# Altium schematic sheet RFCtl.SchDoc
size 420 x 297 mm; Address1: Address1; Address2: Address2; Address3: Address3; Address4: Address4; SheetNumber: 1; Scale: 1:1; Разраб.: Иванов; Обозначение документа: АБВГ.123456.001 Э3; Пров.: Петров; Утв.: Сидоров; Наименование организации: ОАО "Концерн "МПО-Гидроприбор"; Перв. применение: АБВГ.123456.000; Наименование изделия 1: Плата; Наименование изделия 2: Схема электрическая; Наименование изделия 3: принципиальная; Нач. отд.: Нач. отд.; Фамилия нач. отд.: Сидоров
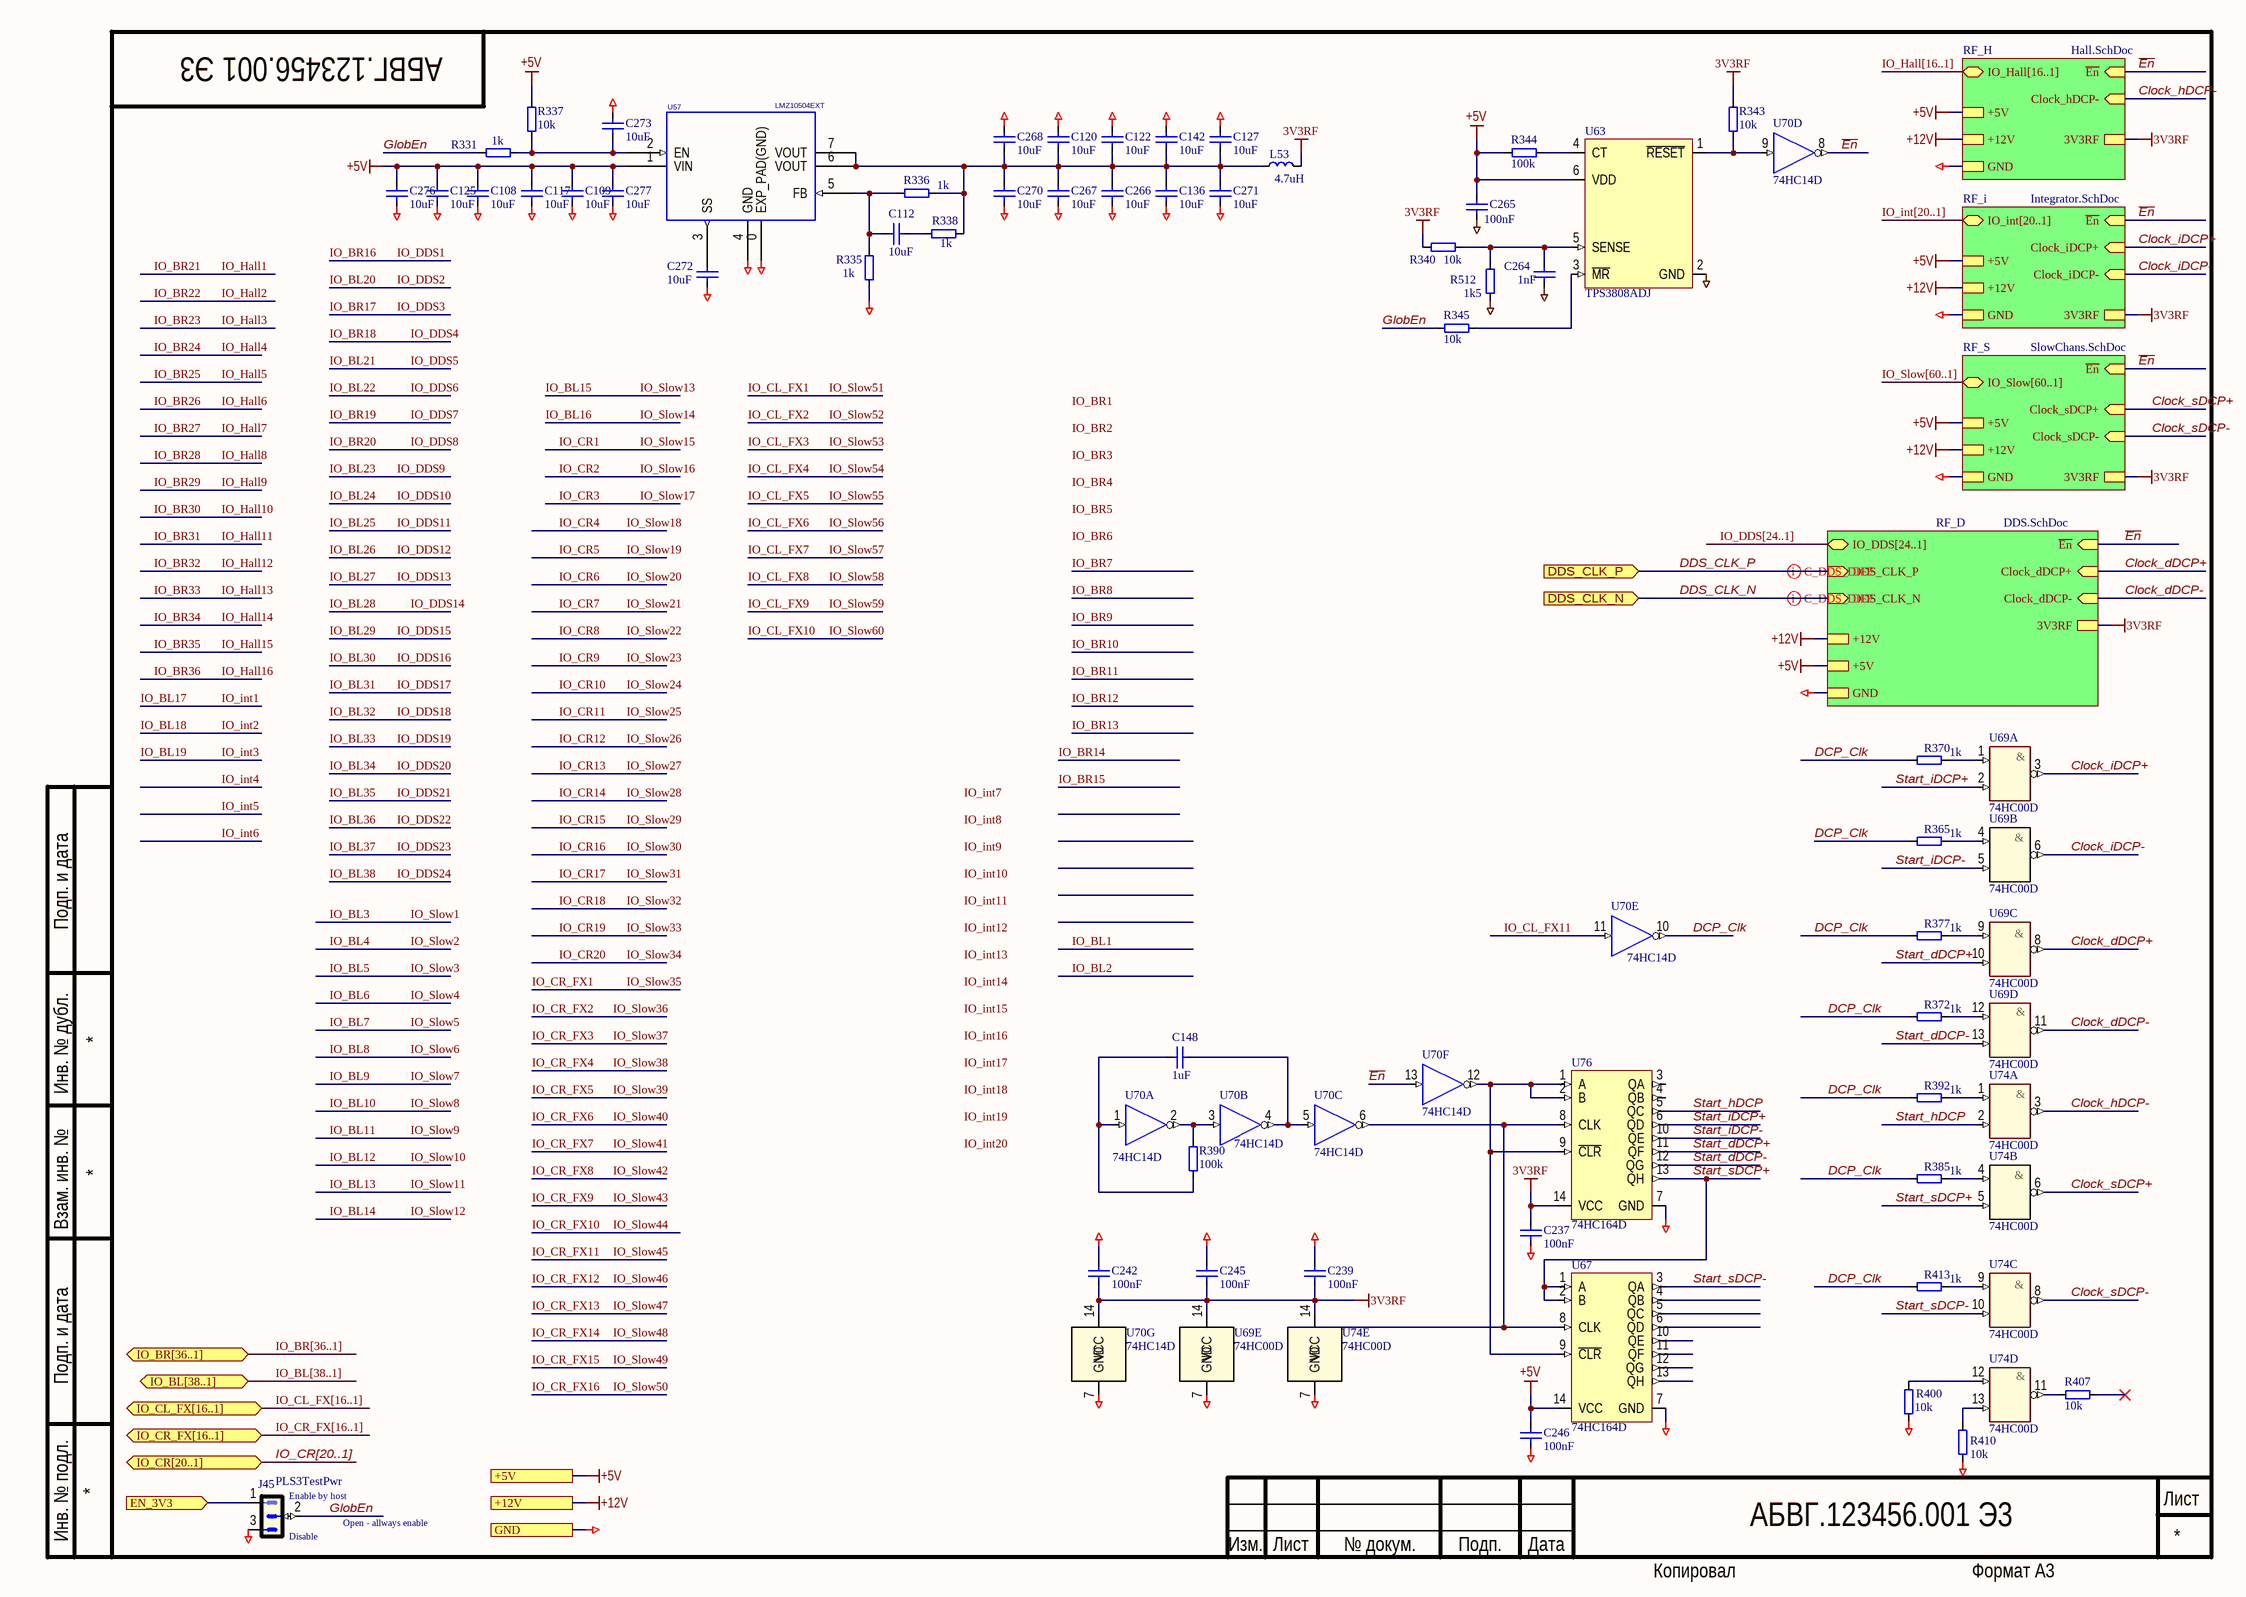
[diagram p0: RFCtl.SchDoc]

## Parts
C108  10uF  [SMD0805CAP]
C109  10uF  [SMD0805CAP]
C112  10uF  [SMD0805CAP]
C117  10uF  [SMD0805CAP]
C120  10uF  [SMD0805CAP]
C122  10uF  [SMD0805CAP]
C125  10uF  [SMD0805CAP]
C127  10uF  [SMD0805CAP]
C136  10uF  [SMD0805CAP]
C142  10uF  [SMD0805CAP]
C148  1uF  [SMD0805CAP]
C237  100nF  [SMD0805CAP]
C239  100nF  [SMD0805CAP]
C242  100nF  [SMD0805CAP]
C245  100nF  [SMD0805CAP]
C246  100nF  [SMD0805CAP]
C264  1nF  [SMD0805CAP]
C265  100nF  [SMD0805CAP]
C266  10uF  [SMD0805CAP]
C267  10uF  [SMD0805CAP]
C268  10uF  [SMD0805CAP]
C270  10uF  [SMD0805CAP]
C271  10uF  [SMD0805CAP]
C272  10uF  [SMD0805CAP]
C273  10uF  [SMD0805CAP]
C276  10uF  [SMD0805CAP]
C277  10uF  [SMD0805CAP]
J45  PLS3TestPwr  [PLS3]
L53  value 4.7uH  [IND_3225_MURATA_LQH_N]  (hidden comment: LQH32PN4R7NN0L)
R331  1k  [SMD0805RES]
R335  1k  [SMD0805RES]
R336  1k  [SMD0805RES]
R337  10k  [SMD0805RES]
R338  1k  [SMD0805RES]
R340  10k  [SMD0805RES]
R343  10k  [SMD0805RES]
R344  100k  [SMD0805RES]
R345  10k  [SMD0805RES]
R365  1k  [SMD0805RES]
R370  1k  [SMD0805RES]
R372  1k  [SMD0805RES]
R377  1k  [SMD0805RES]
R385  1k  [SMD0805RES]
R390  100k  [SMD0805RES]
R392  1k  [SMD0805RES]
R400  10k  [SMD0805RES]
R407  10k  [SMD0805RES]
R410  10k  [SMD0805RES]
R413  1k  [SMD0805RES]
R512  1k5  [SMD0805RES]
U57  LMZ10504EXT  [TO-PMOD7]
U63  TPS3808ADJ  [SOT95P270X145-6N]
U67  74HC164D  [SOIC127P600X175-14N]
U69  74HC00D  [SOIC127P600X175-14N]  (parts A,B,C,D,E of 5)
U70  74HC14D  [SOIC127P600X175-14N]  (parts A,B,C,D,E,F,G of 7)
U74  74HC00D  [SOIC127P600X175-14N]  (parts A,B,C,D,E of 5)
U76  74HC164D  [SOIC127P600X175-14N]

## Sub-sheets
RF_D = DDS.SchDoc: IO_DDS[24..1] (bidir), ~{En} (in), Clock_dDCP- (in), Clock_dDCP+ (in), DDS_CLK_N (in), DDS_CLK_P (in), GND, +5V, 3V3RF, +12V
RF_H = Hall.SchDoc: IO_Hall[16..1] (bidir), ~{En} (in), Clock_hDCP- (in), GND, +12V, +5V, 3V3RF
RF_i = Integrator.SchDoc: IO_int[20..1] (bidir), ~{En} (in), Clock_iDCP- (in), Clock_iDCP+ (in), GND, +12V, +5V, 3V3RF
RF_S = SlowChans.SchDoc: IO_Slow[60..1] (bidir), ~{En} (in), Clock_sDCP- (in), Clock_sDCP+ (in), +5V, +12V, GND, 3V3RF

## Ports
+5V, +12V, DDS_CLK_N (in), DDS_CLK_P (in), EN_3V3 (in), GND, IO_BL[38..1] (bidir), IO_BR[36..1] (bidir), IO_CL_FX[16..1] (bidir), IO_CR[20..1] (bidir), IO_CR_FX[16..1] (bidir)

## Nets
3V3RF: C237.2 C239.1 C242.1 C245.1 L53.2 R340.1 R343.1 U69.14(VCC) U70.14(VCC) U74.14(VCC) U76.14(VCC) ; sheet RF_H/3V3RF, sheet RF_i/3V3RF, sheet RF_D/3V3RF, sheet RF_S/3V3RF
+5V: C108.2 C109.2 C117.2 C125.2 C246.2 C265.2 C276.2 C277.2 R337.2 R344.1 U57.1(VIN) U63.6(VDD) U67.14(VCC) ; port +5V, sheet RF_H/+5V, sheet RF_i/+5V, sheet RF_D/+5V, sheet RF_S/+5V
+12V: port +12V, sheet RF_H/+12V, sheet RF_i/+12V, sheet RF_D/+12V, sheet RF_S/+12V
GND: C108.1 C109.1 C117.1 C120.2 C122.2 C125.1 C127.1 C136.1 C142.2 C237.1 C239.2 C242.2 C245.2 C246.1 C264.1 C265.1 C266.1 C267.1 C268.2 C270.1 C271.1 C272.1 C273.2 C276.1 C277.1 J45.3 R335.1 R400.1 R410.1 R512.1 U57.0(EXP_PAD(GND)) U57.4(GND) U63.2(GND) U67.7(GND) U69.7(GND) U70.7(GND) U74.7(GND) U76.7(GND) ; port GND, sheet RF_H/GND, sheet RF_i/GND, sheet RF_D/GND, sheet RF_S/GND
~{En}: U70.8(OUT) U70.13(IN) ; sheet RF_H/~{En}, sheet RF_i/~{En}, sheet RF_D/~{En}, sheet RF_S/~{En}
Clock_dDCP+: U69.8(OUT) ; sheet RF_D/Clock_dDCP+
Clock_dDCP-: U69.11(OUT) ; sheet RF_D/Clock_dDCP-
Clock_hDCP-: U74.3(OUT) ; sheet RF_H/Clock_hDCP-
Clock_iDCP+: U69.3(OUT) ; sheet RF_i/Clock_iDCP+
Clock_iDCP-: U69.6(OUT) ; sheet RF_i/Clock_iDCP-
Clock_sDCP+: U74.6(OUT) ; sheet RF_S/Clock_sDCP+
Clock_sDCP-: U74.8(OUT) ; sheet RF_S/Clock_sDCP-
DCP_Clk: R365.2 R370.2 R372.2 R377.2 R385.2 R392.2 R413.2 U70.10(OUT)
DDS_CLK_N: port DDS_CLK_N, sheet RF_D/DDS_CLK_N
DDS_CLK_P: port DDS_CLK_P, sheet RF_D/DDS_CLK_P
EN_3V3: J45.1 ; port EN_3V3
GlobEn: J45.2 R331.2 R345.2
IO_CL_FX11: U70.11(IN)
Start_dDCP+: U69.10(IN) U76.11(QF)
Start_dDCP-: U69.13(IN) U76.12(QG)
Start_hDCP: U74.2(IN) U76.5(QC)
Start_iDCP+: U69.2(IN) U76.6(QD)
Start_iDCP-: U69.5(IN) U76.10(QE)
Start_sDCP+: U67.1(A) U67.2(B) U74.5(IN) U76.13(QH)
Start_sDCP-: U67.3(QA) U74.10(IN)
NetC112_1: C112.1 R335.2 R336.1 U57.5(FB)
NetC112_2: C112.2 R338.2
NetC120_1: C120.1 C122.1 C127.2 C136.2 C142.1 C266.2 C267.2 C268.1 C270.2 C271.2 L53.1 R336.2 R338.1 U57.6(VOUT) U57.7(VOUT)
NetC148_1: C148.1 U70.4(OUT) U70.5(IN)
NetC148_2: C148.2 R390.1 U70.1(IN)
NetC264_2: C264.2 R340.2 R512.2 U63.5(SENSE)
NetC272_2: C272.2 U57.3(SS)
NetC273_1: C273.1 R331.1 R337.1 U57.2(EN)
NetR343_2: R343.2 U63.1(~{RESET}) U70.9(IN)
NetR344_2: R344.2 U63.4(CT)
NetR345_1: R345.1 U63.3(~{MR})
NetR365_1: R365.1 U69.4(IN)
NetR370_1: R370.1 U69.1(IN)
NetR372_1: R372.1 U69.12(IN)
NetR377_1: R377.1 U69.9(IN)
NetR385_1: R385.1 U74.4(IN)
NetR390_2: R390.2 U70.2(OUT) U70.3(IN)
NetR392_1: R392.1 U74.1(IN)
NetR400_2: R400.2 U74.12(IN)
NetR407_2: R407.2 U74.11(OUT)
NetR410_2: R410.2 U74.13(IN)
NetR413_1: R413.1 U74.9(IN)
NetU67_8: U67.8(CLK) U70.6(OUT) U76.8(CLK)
NetU67_9: U67.9(~{CLR}) U70.12(OUT) U76.1(A) U76.2(B) U76.9(~{CLR})

Not connected (* = marked no-connect by the designer): R407 1*; U67 4(QB) 5(QC) 6(QD) 10(QE) 11(QF) 12(QG) 13(QH); U76 3(QA) 4(QB)

## Buses and harness runs
bus IO_BL[38..1] = port IO_BL[38..1]
bus IO_BR[36..1] = port IO_BR[36..1]
bus IO_CL_FX[16..1] = port IO_CL_FX[16..1]
bus IO_CR[20..1] = port IO_CR[20..1]
bus IO_CR_FX[16..1] = port IO_CR_FX[16..1]
bus IO_DDS[24..1] = sheet RF_D/IO_DDS[24..1]
bus IO_Hall[16..1] = sheet RF_H/IO_Hall[16..1]
bus IO_int[20..1] = sheet RF_i/IO_int[20..1]
bus IO_Slow[60..1] = sheet RF_S/IO_Slow[60..1]

## Layout directives
differential pair; rule Differential Pairs Routing [Pref Gap = 0.175mm    Min Gap  = 0.075mm    Max Gap  = 0.5mmPref Width = 0.25mm    Min Width  = 0.075mm    Max Width  = 0.5mm]: DDS_CLK_N, DDS_CLK_P

## Notes on the sheet
- (near J45) Disable
- (near J45) Enable by host
- Open - allways enable
- Labels drawn without touching a wire or pin: IO_BR1, IO_BR2, IO_BR3, IO_BR4, IO_BR5, IO_BR6, IO_int7, IO_int8, IO_int9, IO_int10, IO_int11, IO_int12, IO_int13, IO_int14, IO_int15, IO_int16, IO_int17, IO_int18, IO_int19, IO_int20
- Подп. и дата
- Инв. № дубл.
- Взам. инв. №
- Инв. № подл.
- Изм.
- Лист
- № докум.
- Подп.
- Дата
- Копировал
- Формат А3
- (in symbol 74HC00D, part A) &
- (in symbol 74HC00D, part B) &
- (in symbol 74HC00D, part C) &
- (in symbol 74HC00D, part D) &

## Library data of the parts
C108 C109 C117 C120 C122 C125 C127 C136 C142 C266-C268 C270-C273 C276 C277 = C0805: Чип конденсатор 0805; Pkg: SMD0805; Vendor: Vishay; SMD Solders: 2; Tolerance: 20%; Voltage: 25V; DielectricType: X5R; Solder Option: RM; Device: Cap0805; Value: 10uF; Price: 2
C112 C148 C237 C239 C242 C245 C246 C264 C265 = C0805: Чип конденсатор 0805; Voltage: 25V; Vendor: Vishay; DielectricType: X5R; SMD Solders: 2; Solder Option: RM; Tolerance: 20%; Pkg: SMD0805; Device: Cap0805; Price: 2
  C112: Value: 10uF
  C148: Value: 1uF
  C237 C239 C242 C245 C246 C265: Value: 100nF
  C264: Value: 1nF
J45 = PLS3: Vendor: Confly; SMD Solders: 0; Solder Option: RM; THD Solders: 3; Price: 1; Value: TestPwr; Device: PLS3
L53 = LQH32PN4R7NN0L: Inductor, Fixed, 1210, 4.7uH, 216mOhm, 1A, 30%; Pkg: 1210; Vendor: Murata; Maintainer: Evgeniy Kotov; SMD Solders: 2; THD Solders: 0; DC Current: 750mA; Tolerance: 20%; DC Resistance: 380mΩ; PartField: LQH32PN4R7NN0L; Release Date: 30.03.2017; Last Change Data: 30.03.2017; Temperature Range: -40°C to +105°C
R331 R338 R365 R370 R372 R377 R385 R392 R413 = R0805: Чип резистор 0805; Pkg: SMD0805; Vendor: Vishay; SMD Solders: 2; Tolerance: 1%; Solder Option: RM; TC: 100ppm/C; Pwr: 125mW; Device: Res0805; Value: 1k; Price: 2
R335-R337 R340 R343 R345 R390 R400 R407 R410 R512 = R0805: Чип резистор 0805; Vendor: Vishay; SMD Solders: 2; Solder Option: RM; TC: 100ppm/C; Tolerance: 1%; Pkg: SMD0805; Pwr: 125mW; Device: Res0805; Price: 2
  R335 R336: Value: 1k
  R337 R340 R343 R345 R400 R407 R410: Value: 10k
  R390: Value: 100k
  R512: Value: 1k5
R344 = R0805: Чип резистор 0805; Vendor: Vishay; SMD Solders: 2; Solder Option: Dbg; TC: 100ppm/C; Tolerance: 1%; Pkg: SMD0805; Pwr: 125mW; Device: Res0805; Price: 2; Value: 100k
U57 = LMZ10504EXT_NDW: 4A, SIMPLE SWITCHER® Power Module with 5.5V Maximum Input Voltage for Military and Rugged Applications; Manufacturer: Texas Instruments; Manufacturer_Part_Number: lmz10504ext_ndw_7; NSC_PackageReference: TZA07A; Pkg: PMOD-7EP; SMD Solders: 8; THD Solders: 0; Value: LMZ10504EXT; HelpURL: http://www.ti.com/lit/ds/symlink/lmz10504ext.pdf; basePN: LMZ10504EXT; Vendor: Texas Instruments; PartField: LMZ10504EXT
U63 = TPS3808: Supervisory Circuit. Low-Quiescent-Current, Programmable-Delay; Vendor: Texas Instruments; Value: ADJ; Pkg: SOT23-6; SMD Solders: 6; Solder Option: RM; THD Solders: 0; Name to order: TPS3808G01DBV; Current: 6uA; thVoltage: 400mV; Price: 200; Device: TPS3808
U67 U76 = 74HC164D: Сдвиговый регистр. Посл. вх. 8 разр. выход.; Pkg: SOIC14; SMD Solders: 14; Solder Option: RM; THD Solders: 0; Vendor: NXP; Voltage: 2V0.. 6V0; Device: 74HC164D; Price: 30; Name to order: 74HC164D
U69 U74 = 74HC00D: 4 лог. элемента 2И-НЕ; Vendor: NXP; Pkg: SOIC14; SMD Solders: 14; Solder Option: RM; Voltage: 2.. 6V; Price: 50; Device: 74HC00D; Name to order: 74HC00D
U70 = 74HC14D: 6 триггеров Шмита с инверсией.; Vendor: NXP; Pkg: SOIC14; SMD Solders: 14; Solder Option: RM; Voltage: 2.. 6V; Price: 50; Device: 74HC14D; Name to order: 74HC14D